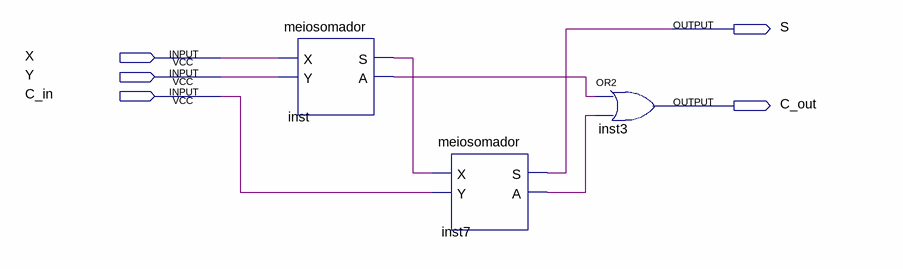
[diagram p0: schematic sheet]
// Quartus schematic somadorcompleto.bdf as structural Verilog: 3 symbols, 5 pins
module somadorcompleto (
  input  X,
  input  Y,
  input  C_in,
  output S,
  output C_out
);

  wire inst7_a, inst_a, inst_s;

  meiosomador inst (.X(X), .Y(Y), .S(inst_s), .A(inst_a));
  meiosomador inst7 (.X(inst_s), .Y(C_in), .S(S), .A(inst7_a));
  or inst3 (C_out, inst_a, inst7_a);
endmodule
